# EAGLE design RasPi-BplusHAT (EAGLE 7.5.0)
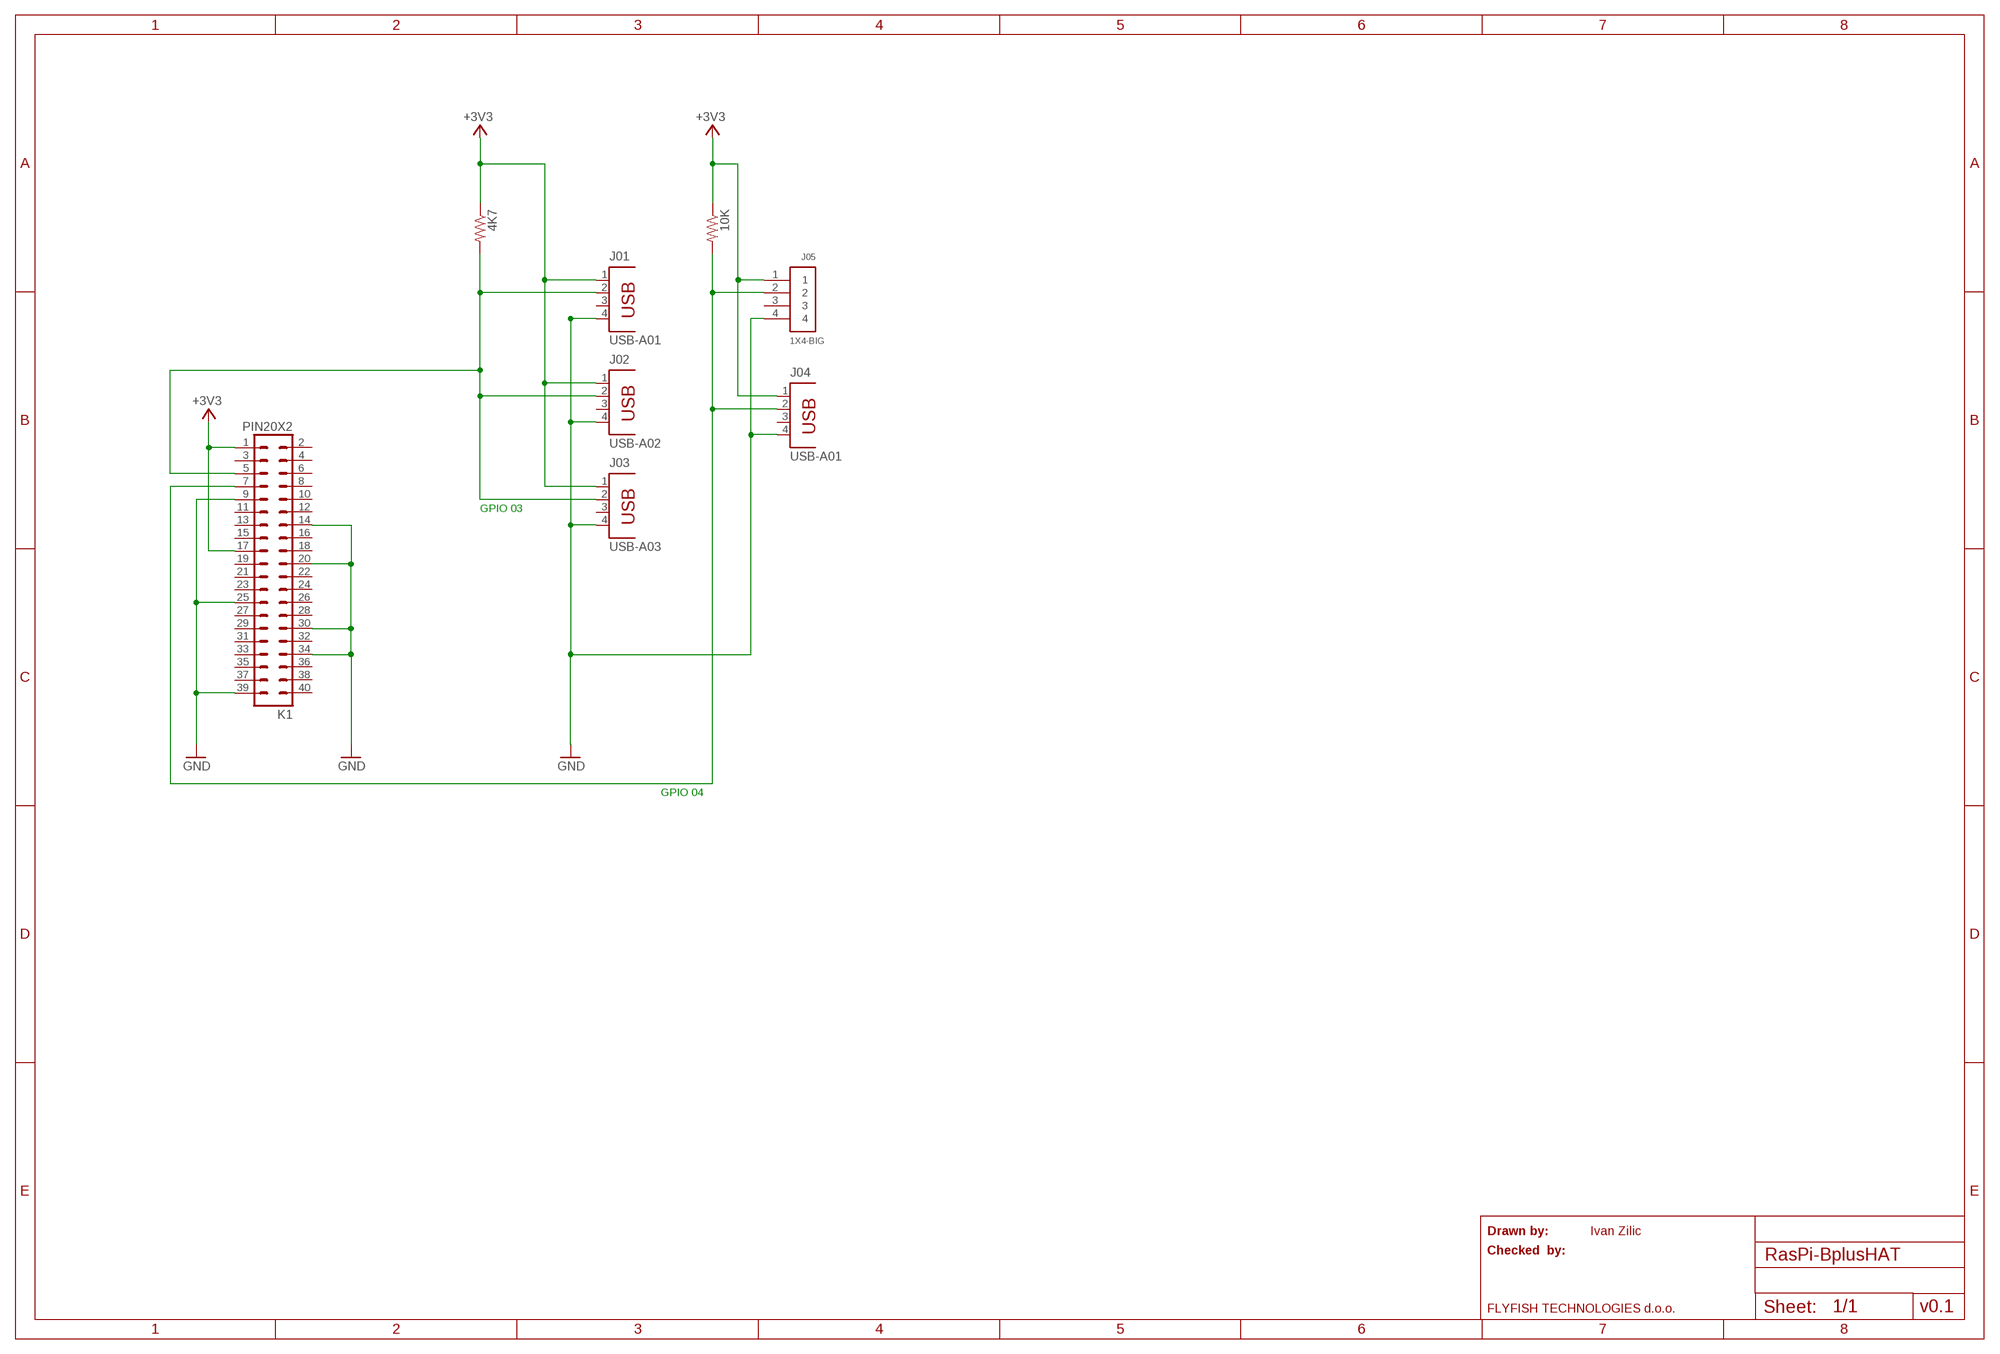
[diagram p0: schematic, sheet 1]

## Parts
4K7  R-US_0204/7  [0204/7]
10K  R-US_0204/7  [0204/7]
J01  USB-A01  PN87520  [PN87520]
J02  USB-A02  PN87520  [PN87520]
J03  USB-A03  PN87520  [PN87520]
J04  USB-A01  PN87520  [PN87520]
J05  1X4-BIG  [1X04-BIG]
K1  PIN20X2  [PIN_20X2]

## Nets
+3V3: 4K7.1 10K.1 J01.1 J02.1 J03.1 J04.1 J05.1 K1.1 K1.17
GND: J01.4 J02.4 J03.4 J04.4 J05.4 K1.9 K1.14 K1.20 K1.25 K1.30 K1.34 K1.39
N$4: 10K.2 J04.2 J05.2 K1.7
TMP01: 4K7.2 J01.2 J02.2 J03.2 K1.5
Unconnected: J01.3 J02.3 J03.3 J04.3 J05.3 K1.2 K1.3 K1.4 K1.6 K1.8 K1.10 K1.11 K1.12 K1.13 K1.15 K1.16 K1.18 K1.19 K1.21 K1.22 K1.23 K1.24 K1.26 K1.27 K1.28 K1.29 K1.31 K1.32 K1.33 K1.35 K1.36 K1.37 K1.38 K1.40

## Notes on the sheet
- GPIO 03
- GPIO 04
- Drawn by: | Ivan Zilic
- Checked  by:
- FLYFISH TECHNOLOGIES d.o.o. | v0.1

## Library data of the parts
4K7 10K = adafruit:R-US_: RESISTOR, American symbol
J01-J04 = con-berg:PN87520: BERG USB connector; OC_FARNELL: unknown; OC_NEWARK: unknown
J05 = adafruit:1X4: 4-pin connector
K1 = FLYFISH:PIN20X2

## Board
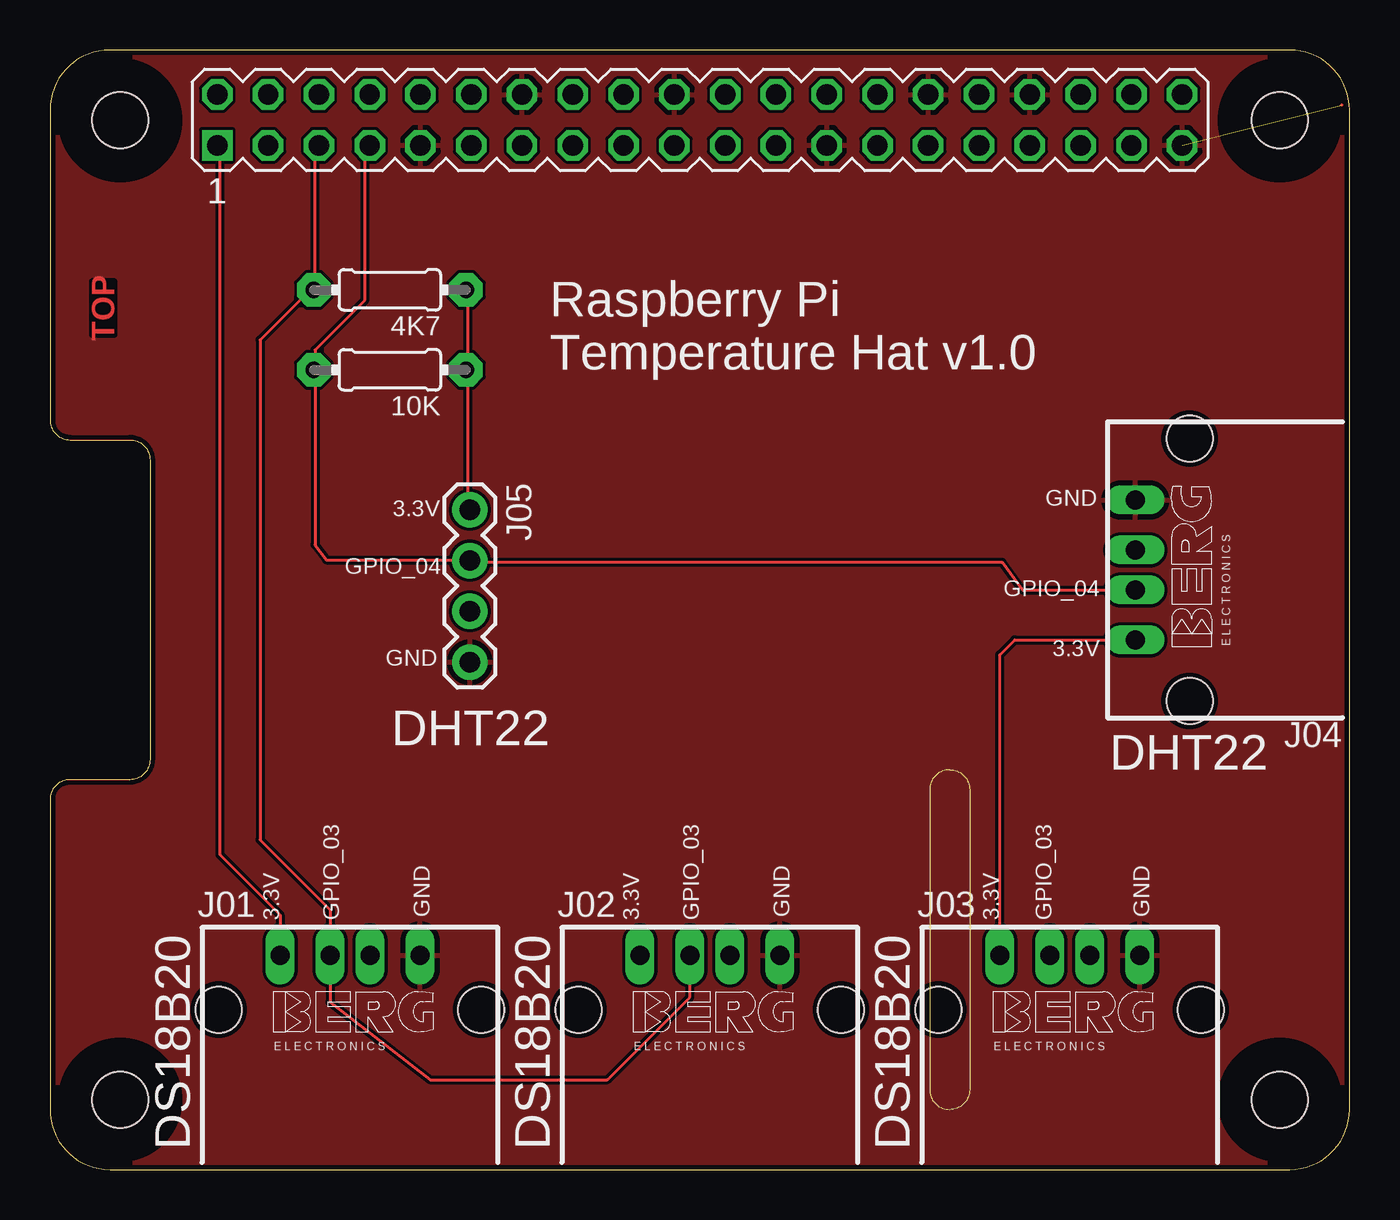
[diagram p1: board, top side]
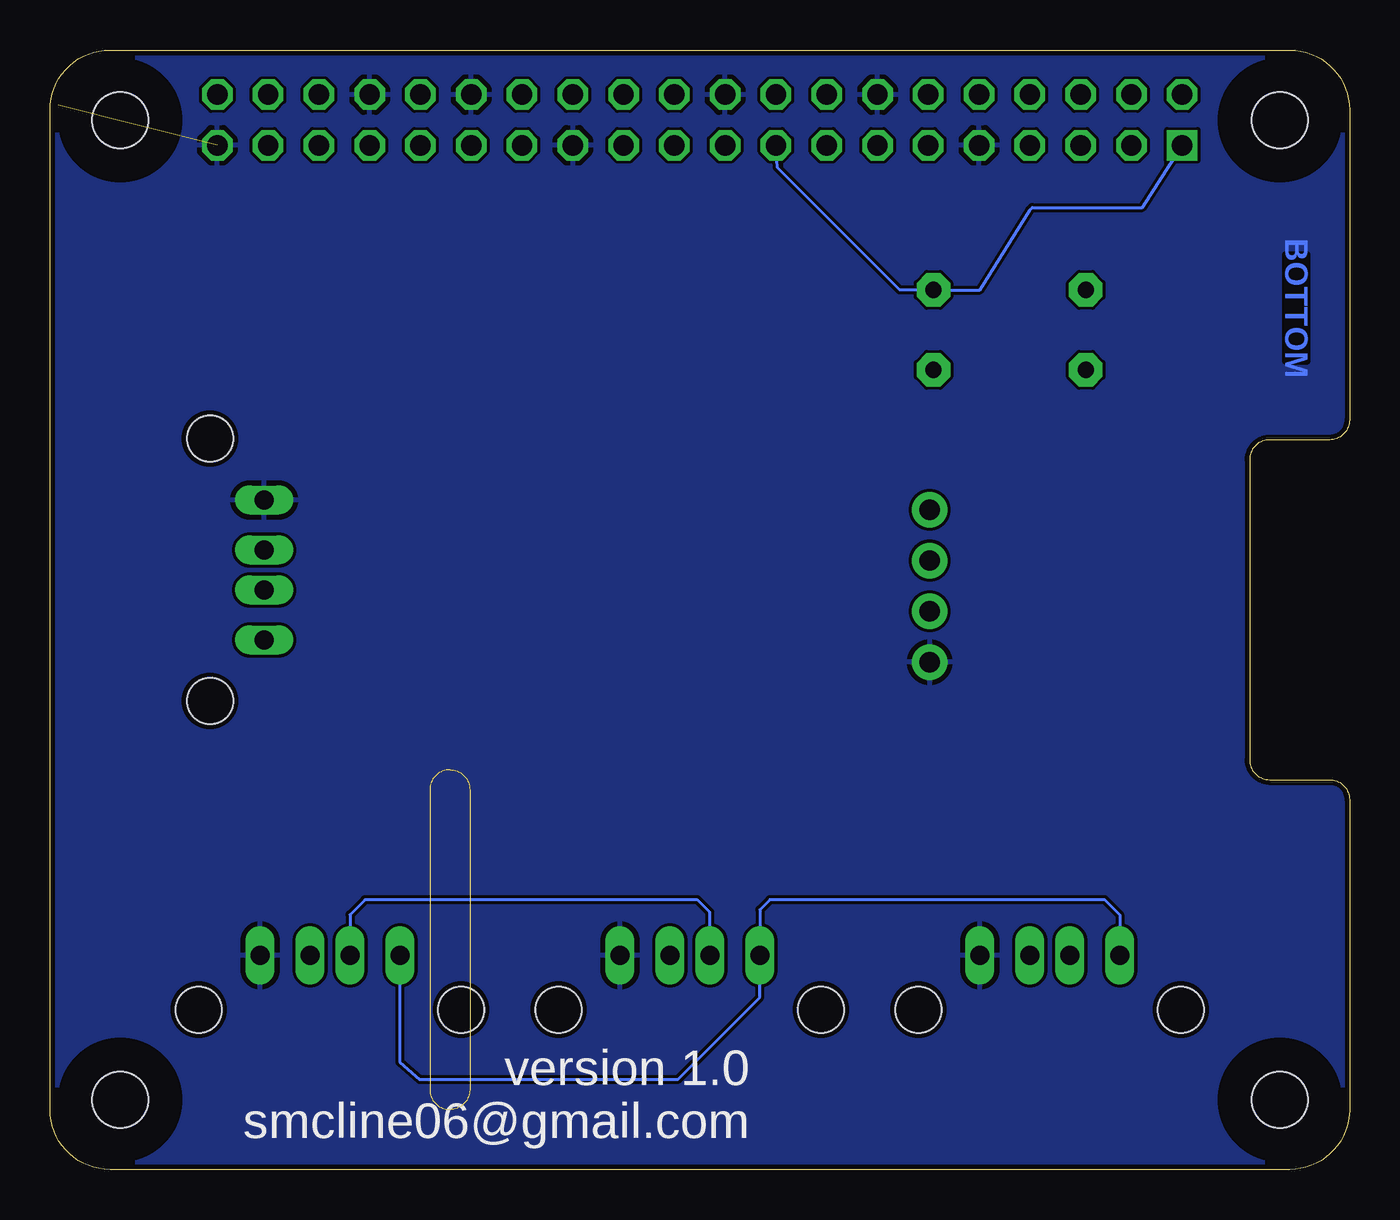
[diagram p2: board, bottom side, seen from below]

Size 65 x 56 mm. Coordinates in mm from the lower left corner, seen from the top.
Outline: 0,3 arc90 3,0 62,0 arc90 65,3 65,53 arc90 62,56 3,56 arc90 0,53 0,37.5 arc90 1,36.5 4,36.5 arc-90 5,35.5 5,20.5 arc-90 4,19.5 1,19.5 arc90 0,18.5 0,3
Copper layers (1*16): Top 0.035mm / dielectric 1.5mm / Bottom 0.035mm
Design rules "ITEADstudio_DRC": minimum track width 6mil, minimum drill 12mil, track to track 6mil, track to pad 6mil, pad to pad 6mil, via to via 6mil, smd to smd 0mil, copper to edge 10mil, drill to drill 10mil, minimum pad ring 10mil, minimum via ring 6mil, stop-mask expansion 2mil, vias tented up to drill 100mil, thermal gap 10mil
Holes 2.8 mm at 3.5,3.5 3.5,52.5 61.5,52.5 61.5,3.5
tRestrict: area 1.9,51 to 5,54; area 60,51 to 63,54; area 60,1.9 to 63,5; area 1.9,1.9 to 5,5
bRestrict: area 1.9,1.9 to 5,5; area 1.9,51 to 5,54; area 60,1.9 to 63,5; area 60,51 to 63,54
Milling: 6 lines

### Footprints (pad centres in the part's own frame; a part is rotated, then mirrored left to right if it is on the bottom)
0204/7 = drill 0.813 pad 1.676 octagon: 1 -3.81,0; 2 3.81,0
PN87520 = drill 0.95 long: 1 -3.5,2.71; 2 -1,2.71; 3 1,2.71; 4 3.5,2.71 | hole 2.3: -6.57,0; 6.57,0
1X04-BIG = drill 1.016 pad 1.778: 1 0,0; 2 2.54,0; 3 5.08,0; 4 7.62,0
PIN_20X2 = drill 1.016 square: 1 -24.13,-1.27 | drill 1.016 octagon: 2 -24.13,1.27; 3 -21.59,-1.27; 4 -21.59,1.27; 5 -19.05,-1.27; 6 -19.05,1.27; 7 -16.51,-1.27; 8 -16.51,1.27; 9 -13.97,-1.27; 10 -13.97,1.27; 11 -11.43,-1.27; 12 -11.43,1.27; 13 -8.89,-1.27; 14 -8.89,1.27; 15 -6.35,-1.27; 16 -6.35,1.27; 17 -3.81,-1.27; 18 -3.81,1.27; 19 -1.27,-1.27; 20 -1.27,1.27; 21 1.27,-1.27; 22 1.27,1.27; 23 3.81,-1.27; 24 3.81,1.27; 25 6.35,-1.27; 26 6.35,1.27; 27 8.89,-1.27; 28 8.89,1.27; 29 11.43,-1.27; 30 11.43,1.27; 31 13.97,-1.27; 32 13.97,1.27; 33 16.51,-1.27; 34 16.51,1.27; 35 19.05,-1.27; 36 19.05,1.27; 37 21.59,-1.27; 38 21.59,1.27; 39 24.13,-1.27; 40 24.13,1.27

### Placement (x,y rotation side)
4K7  17,44 180 top
10K  17,40 180 top
J01  15,8 0 top
J02  33,8 0 top
J03  51,8 0 top
J04  57,30 90 top
J05  21,33 270 top
K1  32.5,52.5 0 top

### Tracks (layer width: path | path; a pad name or v marks a point on that pad's centre or on a via)
+3V3
  Top 0.152: J01.1 11.5,12.75 8.5,15.75 8.5,51 8.38,51.12 K1.1 | 20.88,40 20.88,44 4K7.1 | J05.1 20.88,33.12 20.88,40 | 20.88,40 10K.1 | J03.1 47.5,25.75 48.25,26.5 J04.1
  Bottom 0.152: J01.1 11.5,12.75 12.25,13.5 29,13.5 29.5,13 J02.1 29.5,8.62 33.62,4.5 46.5,4.5 47.5,5.37 J03.1 | K1.1 10.38,48.12 15.88,48.12 16,48 18.5,44 4K7.1 22.5,44 28.62,50.12 K1.17
GND  (1 unrouted)
  Top 0.152: 64.62,53.25 64.6,53.25
  pour Bottom: 0,3 arc90 3,0 62,0 arc90 65,3 65,53 arc90 62,56 3,56 arc90 0,53 0,37.5 arc90 1,36.5 4,36.5 arc-90 5,35.5 5,20.5 arc-90 4,19.5 1,19.5 arc90 0,18.5
  pour Top: 0,3 arc90 3,0 62,0 arc90 65,3 65,53 arc90 62,56 3,56 arc90 0,53 0,37.5 arc90 1,36.5 4,36.5 arc-90 5,35.5 5,20.5 arc-90 4,19.5 1,19.5 arc90 0,18.5
N$4
  Top 0.152: K1.7 15.75,51 15.75,43.5 13.25,41 13.25,40 | 13.25,40 13.25,31.25 13.82,30.5 21,30.5 J05.2 21,30.38 47.62,30.38 48.62,29 J04.2 | 13.25,40 10K.2
  Bottom 0.152: 21,30.38 J05.2
TMP01
  Top 0.152: 13.12,44 4K7.2 | K1.5 13.25,51 13.25,44 4K7.2 | 4K7.2 13,44 10.5,41.5 10.5,16.5 14,13 J01.2 14,8.37 19,4.5 27.88,4.5 32,8.62 J02.2
  Bottom 0.152: J02.2 32,12.88 32.62,13.5 49.25,13.5 50,12.75 J03.2

### Text on the board
Top: TOP
Bottom: BOTTOM
tPlace: Raspberry Pi / Temperature Hat v1.0 | GND | 3.3V | GPIO_04 | GPIO_04 | GND | 3.3V | DHT22 | DHT22 | GND | GND | GND | 3.3V | GPIO_03 | 3.3V | GPIO_03 | 3.3V | GPIO_03 | DS18B20 | DS18B20 | DS18B20
bPlace: version 1.0 / smcline06@gmail.com